# EasyEDA Pro project pdb.eprj, board can-bb5
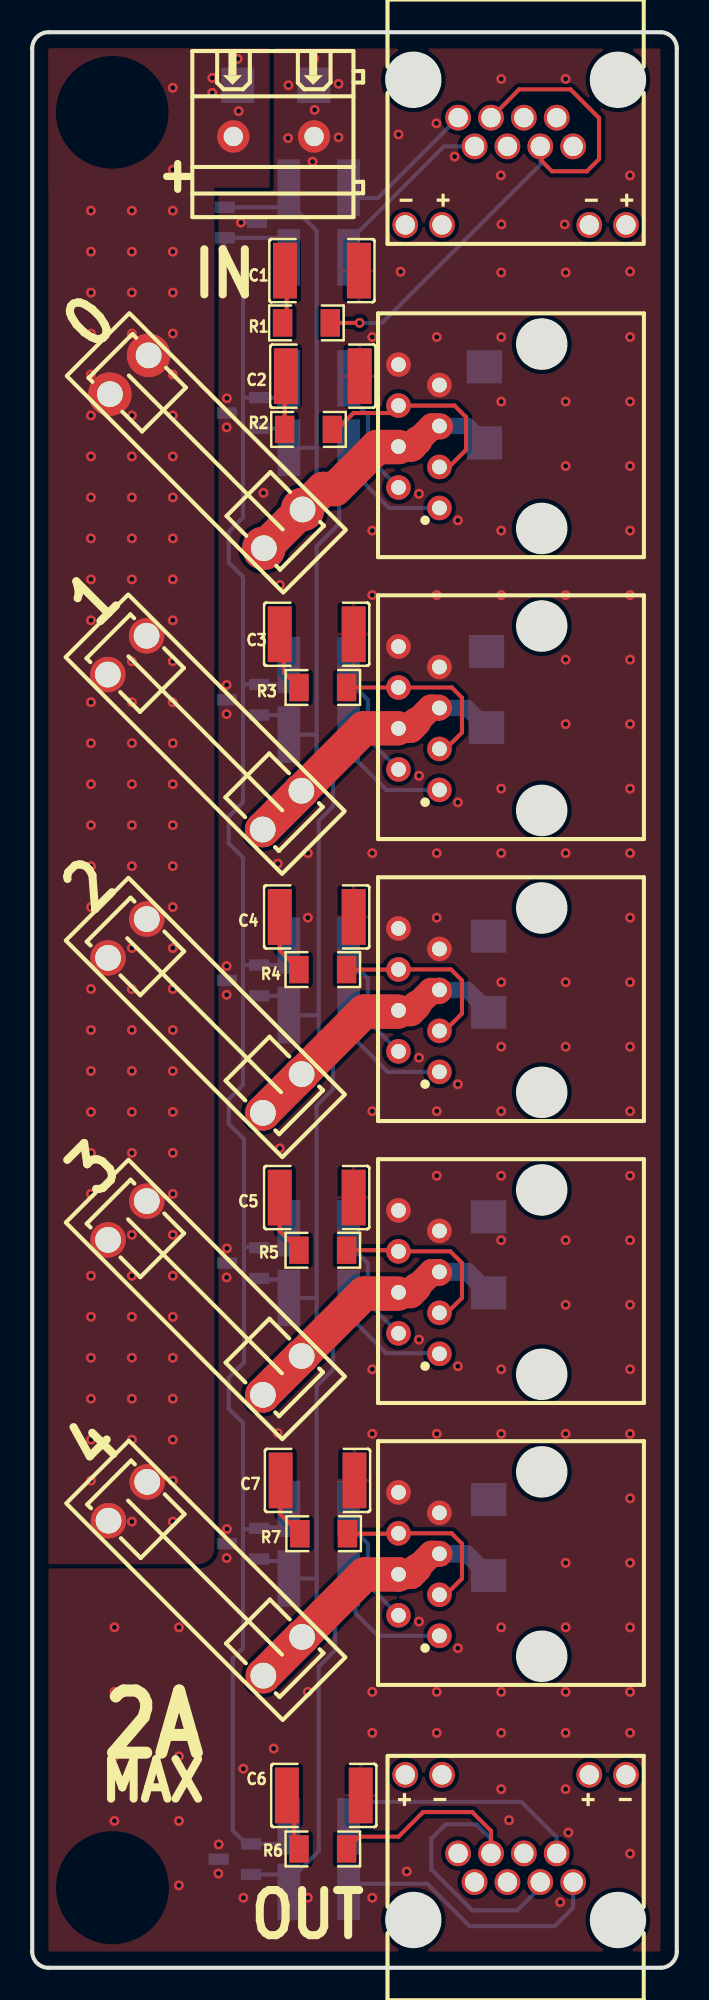
[diagram p7: board, top side]
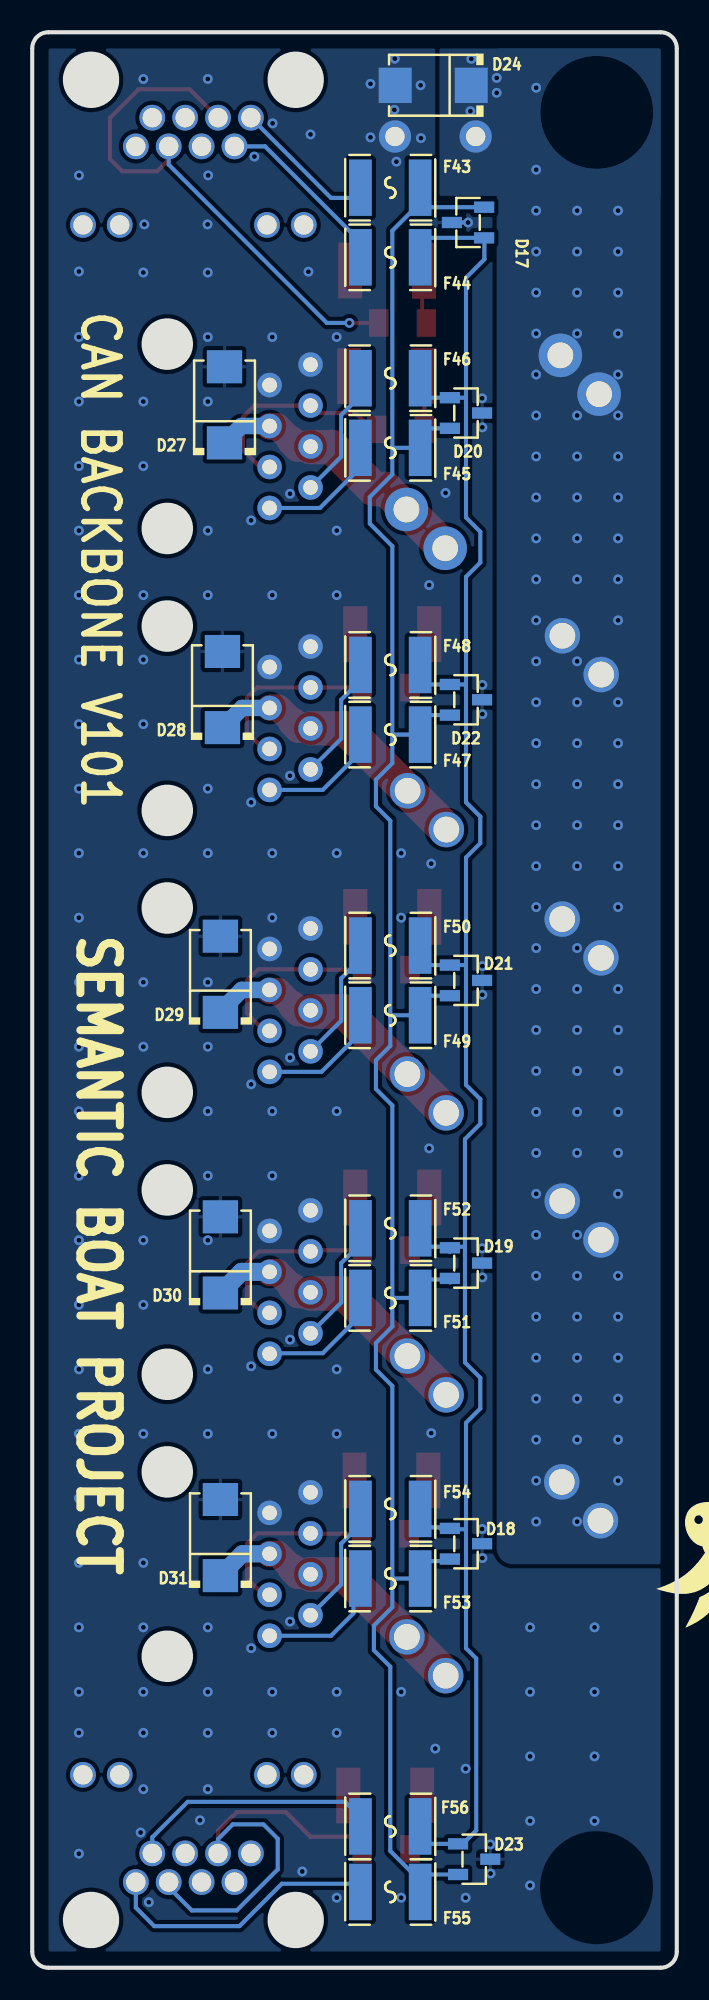
[diagram p8: board, bottom side, seen from below]

Outline 40 x 120 mm; copper layers: Top Layer, Bottom Layer. Coordinates in mm from the lower left corner of the outline.
Outline path: 0,119 0,1 arc(0.29,0.29) 1,0 39,0 arc(39.71,0.29) 40,1 40,119 arc(39.71,119.71) 39,120 1,120 arc(0.29,119.71) 0,119
Stack: Top Layer 0.035mm / Dielectric1 1.51mm FR4 er 4.5 / Bottom Layer 0.035mm

## Design rules (mm)
template: Custom Config
spacing copperThickness1oz (default): track to track 0.102, other pairs 0.152 to 0.3
spacing copperThickness2oz: track to track 0.203, other pairs 0.152 to 0.3
track width copperThickness1oz (default): min 0.127, default 0.254, max 10
track width copperThickness2oz: min 0.203, default 0.254, max 2.54
differential pair differentialPair (default): width min 0.127, default 0.254, max 2.54; gap min 0.152, default 0.152
via viaSize (default): diameter min 0.5, default 0.61, max 10; hole min 0.3, default 0.305, max 6.3

## Placement (name value [footprint] x y rotation side)
C1  100nF  [C1812]  17.98 105.22 180 top
C2  100nF  [C1812]  18.03 98.68 180 top
C3  100nF  [C1812]  17.65 82.68 180 top
C4  100nF  [C1812]  17.65 65.15 180 top
C5  100nF  [C1812]  17.65 47.75 180 top
C6  100nF  [C1812]  18.09 10.68 180 top
C7  100nF  [C1812]  17.71 30.21 180 top
D17  PESD2CAN  [SOT-23-3_L2.9-W1.3-P1.90-LS2.4-BR]  12.95 108.2 180 bottom
D18  PESD2CAN  [SOT-23-3_L2.9-W1.3-P1.90-LS2.4-BR]  13.08 26.29 0 bottom
D19  PESD2CAN  [SOT-23-3_L2.9-W1.3-P1.90-LS2.4-BR]  13.08 43.69 0 bottom
D20  PESD2CAN  [SOT-23-3_L2.9-W1.3-P1.90-LS2.4-BR]  13.08 96.39 0 bottom
D21  PESD2CAN  [SOT-23-3_L2.9-W1.3-P1.90-LS2.4-BR]  13.08 61.21 0 bottom
D22  PESD2CAN  [SOT-23-3_L2.9-W1.3-P1.90-LS2.4-BR]  13.08 78.61 0 bottom
D23  PESD2CAN  [SOT-23-3_L2.9-W1.3-P1.90-LS2.4-BR]  12.57 6.73 0 bottom
D24  SMBJ20A  [SMB_L4.6-W3.6-LS5.3-RD]  15.11 116.71 0 bottom
D27  SMBJ20A  [SMB_L4.6-W3.6-LS5.3-RD]  28.07 96.9 90 bottom
D28  SMBJ20A  [SMB_L4.6-W3.6-LS5.3-RD]  28.19 79.25 90 bottom
D29  SMBJ20A  [SMB_L4.6-W3.6-LS5.3-RD]  28.32 61.59 90 bottom
D30  SMBJ20A  [SMB_L4.6-W3.6-LS5.3-RD]  28.32 44.2 90 bottom
D31  SMBJ20A  [SMB_L4.6-W3.6-LS5.3-RD]  28.32 26.67 90 bottom
F01  T508  [CONN-TH_T508#2]  6.02 98.77 225 top
F02  T508  [CONN-TH_T508#2]  15.58 89.21 45 top
F11  T508  [CONN-TH_T508]  5.9 81.38 225 top
F12  T508  [CONN-TH_T508]  15.5 71.77 45 top
F21  T508  [CONN-TH_T508]  5.91 63.81 225 top
F22  T508  [CONN-TH_T508]  15.52 54.21 45 top
F31  T508  [CONN-TH_T508]  5.91 46.33 225 top
F32  T508  [CONN-TH_T508]  15.52 36.72 45 top
F41  T508  [CONN-TH_T508]  5.94 28.92 225 top
F42  T508  [CONN-TH_T508]  15.55 19.31 45 top
F43  MF-MSMF010-2  [F1812]  17.78 110.36 0 bottom
F44  MF-MSMF010-2  [F1812]  17.78 106.05 0 bottom
F45  MF-MSMF010-2  [F1812]  17.78 94.23 0 bottom
F46  MF-MSMF010-2  [F1812]  17.78 98.55 0 bottom
F47  MF-MSMF010-2  [F1812]  17.78 76.45 0 bottom
F48  MF-MSMF010-2  [F1812]  17.78 80.77 0 bottom
F49  MF-MSMF010-2  [F1812]  17.78 59.06 0 bottom
F50  MF-MSMF010-2  [F1812]  17.78 63.37 0 bottom
F51  MF-MSMF010-2  [F1812]  17.78 41.53 0 bottom
F52  MF-MSMF010-2  [F1812]  17.78 45.85 0 bottom
F53  MF-MSMF010-2  [F1812]  17.78 24.13 0 bottom
F54  MF-MSMF010-2  [F1812]  17.78 28.45 0 bottom
F55  MF-MSMF010-2  [F1812]  17.78 4.7 180 bottom
F56  MF-MSMF010-2  [F1812]  17.78 8.76 180 bottom
P1  WJ128V-5.0-02P-14-00A  [CONN-TH_2P-P5.00_WJ128V-5.0-2P]  14.99 113.54 180 top
R1  100Ω  [R1206]  17.02 101.98 0 top
R2  100Ω  [R1206]  17.15 95.38 0 top
R3  100Ω  [R1206]  18.03 79.38 0 top
R4  100Ω  [R1206]  18.03 61.89 0 top
R5  100Ω  [R1206]  18.03 44.49 0 top
R6  100Ω  [R1206]  18.03 7.37 0 top
R7  100Ω  [R1206]  18.09 26.91 0 top
RJ0  R-RJ45S08P-A004  [RJ45-TH_CKMTW_R-RJ45S08P-A004]  24 94.95 90 top
RJ1  R-RJ45S08P-A004  [RJ45-TH_CKMTW_R-RJ45S08P-A004]  24 77.47 90 top
RJ2  R-RJ45S08P-A004  [RJ45-TH_CKMTW_R-RJ45S08P-A004]  24 59.99 90 top
RJ3  R-RJ45S08P-A004  [RJ45-TH_CKMTW_R-RJ45S08P-A004]  24 42.51 90 top
RJ4  R-RJ45S08P-A004  [RJ45-TH_CKMTW_R-RJ45S08P-A004]  24 25.03 90 top
RJIN1  HC-RJ45-5JA-1-5  [RJ45-TH_HC-RJ45-5JA-1-5]  30 111.38 180 top
RJOUT1  HC-RJ45-5JA-1-5  [RJ45-TH_HC-RJ45-5JA-1-5]  30 8.64 0 top

## Footprints (pads in the part's own frame, mm; a bottom-side part is the same pattern mirrored in y, then rotated)
C1812
  rect 1.485x3.456 smd: 1(-2.292,0) 2(2.292,0)
CONN-TH_2P-P5.00_WJ128V-5.0-2P
  round 2 hole 1.2: 1(-2.505,0) 2(2.505,0)
CONN-TH_T508
  round 2.2 hole 1.6: 1(1.7,0) 2(-1.7,0)
CONN-TH_T508#2
  round 2.7 hole 1.6: 1(1.7,0) 2(-1.7,0)
F1812
  rect 1.407x3.499 smd: 1(-1.853,0) 2(1.853,0)
R1206
  rect 1.208x1.701 smd: 1(-1.479,0) 2(1.479,0)
RJ45-TH_CKMTW_R-RJ45S08P-A004
  round 1.524 hole 0.914: 1(-4.445,-1.27) 2(-3.175,1.27) 3(-1.905,-1.27) 4(-0.635,1.27) 5(0.635,-1.27) 6(1.905,1.27) 7(3.175,-1.27) 8(4.445,1.27)
RJ45-TH_HC-RJ45-5JA-1-5
  round 1.6 hole 1.2: 1(3.57,-3.325) 2(2.55,-1.545) 3(1.53,-3.325) 4(0.51,-1.545) 5(-0.51,-3.325) 6(-1.53,-1.545) 7(-2.55,-3.325) 8(-3.57,-1.545) 9(-6.85,3.325) 10(-4.57,3.325) 11(4.57,3.325) 12(6.85,3.325)
SMB_L4.6-W3.6-LS5.3-RD
  rect 2.047x2.192 smd: 1(-2.361,0) 2(2.361,0)
SOT-23-3_L2.9-W1.3-P1.90-LS2.4-BR
  rect 1.25x0.7 smd: 1(1,-0.95) 2(1,0.95) 3(-1,0)

## Nets
As in the schematic.

Pads without a net: RJIN1 4 5 7 8 9 10 11 12; RJOUT1 4 5 7 8 9 10 11 12

## Via types
v1: diameter 0.61, hole 0.305, Top Layer to Bottom Layer, 241 vias

## Routing (per net, layer and track width the routed paths; a pad name or vN(x,y) marks a point on that pad's centre or on a via; arc(x,y) is an arc through that point)
GND: length 1
  Bottom Layer w0.254: D17.3 v1(12.95,108.2)
  vias: v1(5.1,21.1) v1(5.1,17.1) v1(5.1,13.1) v1(5.1,9.1) v1(9.1,21.1) v1(9.1,17.1) v1(9.1,13.1) v1(9.1,9.1) v1(9.1,5.1) v1(11.57,7.65) v1(11.56,5.84) v1(12.08,97.31) v1(12.06,95.5) v1(12.06,79.54) v1(12.06,77.72) v1(12.06,62.1) v1(12.06,60.33) v1(12.08,44.6) v1(12.06,42.8) v1(12.08,27.2) v1(12.06,25.4) v1(13.1,12.34) v1(13.1,4.34) v1(14.35,91.44) v1(14.99,13.59) v1(15.24,68.45) v1(15.24,33.15) v1(15.37,85.72) v1(15.37,50.8) v1(15.9,116.71) v1(15.88,113.44) v1(17.1,69.1) v1(17.1,65.1) v1(17.1,17.1) v1(17.1,4.34) v1(17.4,111.98) v1(17.5,118.36) v1(17.53,115.19) v1(19.01,116.8) v1(19.01,113.48) v1(21.1,101.1) v1(21.1,89.1) v1(21.1,85.1) v1(21.1,69.1) v1(21.1,53.1) v1(21.1,37.1) v1(21.1,33.1) v1(21.1,17.1) v1(21.1,14.56) v1(21.1,4.34) v1(22.73,113.66) v1(22.86,105.16) v1(23.24,5.97) v1(24,91.39) v1(24,73.91) v1(24,56.42) v1(24,38.94) v1(24,21.46) v1(25.08,114.35) v1(25.1,101.1) v1(25.1,85.1) v1(25.1,69.1) v1(25.1,65.1) v1(25.1,53.1) v1(25.1,49.1) v1(25.1,33.1) v1(25.1,17.1) v1(25.1,14.56) v1(26.21,112.29) v1(26.42,89.73) v1(26.42,72.25) v1(26.42,54.77) v1(26.42,37.29) v1(26.42,19.81) v1(29.1,117.1) v1(29.08,111.12) v1(29.12,108.09) v1(29.1,105.1) v1(29.1,101.1) v1(29.1,97.1) v1(29.1,89.1) v1(29.1,85.1) v1(29.1,73.1) v1(29.1,69.1) v1(29.1,61.1) v1(29.1,57.1) v1(29.1,53.1) v1(29.1,49.1) v1(29.1,45.1) v1(29.1,37.1) v1(29.1,33.1) v1(29.1,21.1) v1(29.1,17.1) v1(29.1,14.56) v1(29.1,11.07) v1(29.59,9.14) v1(32.77,4.06) v1(33.04,108.09) v1(33.1,117.1) v1(33.1,105.1) v1(33.1,97.1) v1(33.1,93.1) v1(33.1,85.1) v1(33.1,81.1) v1(33.1,77.1) v1(33.1,69.1) v1(33.1,61.1) v1(33.1,57.1) v1(33.1,45.1) v1(33.1,41.1) v1(33.1,33.1) v1(33.1,25.1) v1(33.1,21.1) v1(33.1,17.1) v1(33.1,14.56) v1(33.1,11.07) v1(33.27,8.38) v1(37.1,111.12) v1(37.1,105.17) v1(37.1,101.1) v1(37.1,97.1) v1(37.1,93.1) v1(37.1,89.1) v1(37.1,85.1) v1(37.1,81.1) v1(37.1,77.1) v1(37.1,73.1) v1(37.1,69.1) v1(37.1,65.1) v1(37.1,61.1) v1(37.1,57.1) v1(37.1,53.1) v1(37.1,49.1) v1(37.1,45.1) v1(37.1,41.1) v1(37.1,37.1) v1(37.1,33.1) v1(37.1,29.1) v1(37.1,25.1) v1(37.1,21.1) v1(37.1,17.1) v1(37.1,14.56) v1(37.1,7.07)
VCC:
  vias: v1(3.64,108.94) v1(3.64,106.4) v1(3.64,103.86) v1(3.64,101.32) v1(3.64,98.78) v1(3.64,96.24) v1(3.64,93.7) v1(3.64,91.16) v1(3.64,88.62) v1(3.64,86.08) v1(3.64,83.54) v1(3.64,78.46) v1(3.64,75.92) v1(3.64,73.38) v1(3.64,70.84) v1(3.64,68.3) v1(3.64,65.76) v1(3.64,60.68) v1(3.64,58.14) v1(3.64,55.6) v1(3.64,53.06) v1(3.64,50.52) v1(3.64,47.98) v1(3.64,42.9) v1(3.64,40.36) v1(3.64,37.82) v1(3.64,35.28) v1(3.64,32.74) v1(3.64,30.2) v1(6.18,108.94) v1(6.18,106.4) v1(6.18,103.86) v1(6.18,101.32) v1(6.18,96.24) v1(6.18,93.7) v1(6.18,91.16) v1(6.18,88.62) v1(6.18,86.08) v1(6.18,81) v1(6.18,78.46) v1(6.18,75.92) v1(6.18,73.38) v1(6.18,70.84) v1(6.18,68.3) v1(6.18,63.22) v1(6.18,60.68) v1(6.18,58.14) v1(6.18,55.6) v1(6.18,53.06) v1(6.18,50.52) v1(6.18,45.44) v1(6.18,42.9) v1(6.18,40.36) v1(6.18,37.82) v1(6.18,35.28) v1(6.18,32.74) v1(6.18,27.66) v1(8.72,116.56) v1(8.72,111.48) v1(8.72,108.94) v1(8.72,106.4) v1(8.72,103.86) v1(8.72,101.32) v1(8.72,98.78) v1(8.72,96.24) v1(8.72,93.7) v1(8.72,91.16) v1(8.72,88.62) v1(8.72,86.08) v1(8.72,83.54) v1(8.72,81) v1(8.72,78.46) v1(8.72,75.92) v1(8.72,73.38) v1(8.72,70.84) v1(8.72,68.3) v1(8.72,65.76) v1(8.72,63.22) v1(8.72,60.68) v1(8.72,58.14) v1(8.72,55.6) v1(8.72,53.06) v1(8.72,50.52) v1(8.72,47.98) v1(8.72,45.44) v1(8.72,42.9) v1(8.72,40.36) v1(8.72,37.82) v1(8.72,35.28) v1(8.72,32.74) v1(8.72,30.2) v1(8.72,27.66) v1(11.18,117.17) v1(11.18,116.25) v1(12.75,118.35) v1(12.81,115.11)
$1N12647: length 17.3
  Top Layer w1.625: 25.3,95.56 24.81,95.56 23.91,94.66
  Top Layer w1.829: 23.91,94.66 23.54,94.29 22.76,94.29
  Top Layer w2.134: 22.75,94.28 21.4,94.28 18.8,91.68 18.05,91.68 F02.1
  Top Layer w2.184: F02.2 F02.1
  Bottom Layer w1.016: D27.1 27.02,95.59 RJ0.5
$1N13070: length 17.5
  Top Layer w1.625: 23.83,77.22 24.73,78.12 25.23,78.12
  Top Layer w1.829: 23.83,77.22 23.46,76.85 22.69,76.85
  Top Layer w2.134: 22.68,76.84 20.58,76.84 F12.1
  Top Layer w2.184: F12.2 F12.1
  Bottom Layer w1.016: D28.1 26.98,78.11 RJ1.5
$1N13136: length 17.5
  Top Layer w1.625: 23.85,59.66 24.75,60.56 25.24,60.56
  Top Layer w1.829: 23.85,59.66 23.48,59.29 22.7,59.29
  Top Layer w2.134: F22.1 20.59,59.28 22.69,59.28
  Top Layer w2.184: F22.2 F22.1
  Bottom Layer w1.016: 28.19,59.36 28.19,59.44 27,60.62 RJ2.5
$1N13202: length 17.5
  Top Layer w1.625: 23.85,42.18 24.8,43.13 25.19,43.13 25.24,43.07
  Top Layer w1.829: 22.7,41.8 23.48,41.8 23.85,42.18
  Top Layer w2.134: F32.1 20.59,41.79 22.69,41.79
  Top Layer w2.184: 14.31,35.52 F32.1
  Bottom Layer w1.117: RJ3.5 27.01,43.14 28.19,41.96
$1N14122: length 33.8
  Top Layer w0.254: RJIN1.3 30.22,116.46 33.4,116.46 35.18,114.68 35.18,112.14 34.42,111.38 32.26,111.38 31.62,112.01 31.62,112.83 RJIN1.6 ; 18.75,101.98 v1(20.32,101.98)
  Bottom Layer w0.254: RJIN1.6 31.53,111.79 21.72,101.98 v1(20.32,101.98)
$1N14137: length 13.2
  Top Layer w0.254: 18.62,95.63 19.18,95.63 19.94,96.39 22.27,96.39 RJ0.6 26.21,96.86 26.92,96.14 26.92,94.11 25.86,93.05 RJ0.3
$1N14157: length 11.4
  Top Layer w0.254: RJ1.6 26.03,79.38 26.67,78.74 26.67,76.58 25.66,75.57 RJ1.3 ; R3.2 22.73,79.38
$1N14180: length 11.3
  Top Layer w0.254: R4.2 22.72,61.89 RJ2.6 25.99,61.89 26.67,61.21 26.67,59.16 25.6,58.08 RJ2.3
$1N14200: length 11.4
  Top Layer w0.254: RJ3.3 25.75,40.6 26.67,41.53 26.67,43.69 25.94,44.41 RJ3.6 22.66,44.49 R5.2
$1N14223: length 27.8
  Top Layer w0.254: RJOUT1.6 28.47,8.49 27.31,9.65 24.26,9.65 22.73,8.13 20.28,8.13 R6.2
  Bottom Layer w0.254: RJOUT1.6 28.47,7.98 27.56,8.89 25.65,8.89 24.76,8 24.76,6.1 27.31,3.56 30.1,3.56 31.53,4.99 RJOUT1.3
$1N14688: length 3.6
  Top Layer w0.254: 15.8,10.68 16.26,10.23 16.26,7.66 16.56,7.37
$1N14698: length 3.8
  Top Layer w0.254: R5.1 15.36,45.68 C5.2
$1N14709: length 3.8
  Top Layer w0.254: C4.2 15.37,65.14 15.37,63.07 R4.1
$1N14720: length 3.8
  Top Layer w0.254: C3.2 15.62,82.42 15.62,80.31 16.56,79.38
$1N14731: length 3.3
  Top Layer w0.254: 15.67,95.63 15.67,98.86 15.74,98.93
$1N14742: length 3.3
  Top Layer w0.254: 15.68,105.47 15.79,105.37 15.79,102.23
$1N16789: length 17.5
  Top Layer w1.625: RJ4.5 24.77,25.66 23.88,24.76
  Top Layer w1.829: 23.88,24.76 23.5,24.39 RJ4.4
  Top Layer w2.134: RJ4.4 22.72,24.38 20.62,24.38 16.75,20.51
  Top Layer w2.184: F42.2 16.75,20.51
  Bottom Layer w1.067: RJ4.5 26.97,25.66 28.19,24.44
$1N16794: length 11.4
  Top Layer w0.254: 19.56,26.91 22.71,26.91 RJ4.6 26.03,26.93 26.67,26.29 26.67,24.13 25.66,23.12 RJ4.3
$1N16795: length 3.8
  Top Layer w0.254: C7.2 15.41,28.11 R7.1
$1N19163: length 7.9
  Bottom Layer w0.254: F45.2 19.63,93.02 22.14,90.51 RJ0.1
$1N19241: length 8.1
  Bottom Layer w0.254: F46.2 19.63,97.46 20.83,96.27 20.83,93.68 RJ0.2
$1N19280: length 9.1
  Bottom Layer w0.254: F43.2 20.27,109.73 21.45,109.73 RJIN1.1
$1N19317: length 11.2
  Bottom Layer w0.254: F44.2 19.63,107.01 25.55,112.92 RJIN1.2
$1N19397: length 7.7
  Bottom Layer w0.254: RJ1.1 21.97,73.03 20.07,74.93 20.07,76.02 F47.2
$1N19475: length 7.8
  Bottom Layer w0.254: F48.2 19.63,79.81 20.83,78.61 20.83,76.2 RJ1.2
$1N19555: length 7.7
  Bottom Layer w0.254: RJ2.1 22.05,55.55 20.07,57.53 20.07,58.62 F49.2
$1N19633: length 7.8
  Bottom Layer w0.254: RJ2.2 20.83,58.72 20.83,61.34 19.63,62.54 F50.2
$1N19713: length 7.5
  Bottom Layer w0.254: RJ3.1 25.23,38.1 21.97,38.1 20.07,40 20.07,40.84 19.63,41.28
$1N19791: length 7.5
  Bottom Layer w0.254: 19.63,45.59 19.63,44.88 20.83,43.69 20.83,41.24 RJ3.2
$1N19871: length 8.1
  Bottom Layer w0.254: F53.2 20.07,23.7 20.07,21.97 21.45,20.58 RJ4.1
$1N19949: length 7.6
  Bottom Layer w0.254: RJ4.2 20.83,23.76 20.83,26.29 19.63,27.48 19.63,28.19
$1N20029: length 17.3
  Bottom Layer w0.254: F55.1 20.14,5.21 24.51,5.21 27.14,2.58 32.43,2.58 33.57,3.72 RJOUT1.1
$1N20061: length 140.9
  Bottom Layer w0.254: 17.65,94.29 17.65,92.58 19.05,91.19 19.05,89.53 17.65,88.14 17.65,76.4 ; 17.65,94.29 17.65,107.7 15.93,109.42 ; 17.65,94.29 17.59,94.23 F45.1 15.93,94.94 15.43,95.44 D20.2 ; 17.65,41.59 17.65,53.47 18.67,54.48 18.67,56.26 17.78,57.15 17.78,58.98 ; 17.65,41.59 17.65,39.75 18.67,38.74 18.67,37.08 17.65,36.07 17.65,24.11 ; 17.65,41.59 17.59,41.53 F51.1 15.93,42.24 15.49,42.67 14.27,42.67 14.08,42.48 ; F43.1 15.93,109.65 15.43,109.15 D17.2 ; 15.93,5.39 F55.2 ; 15.93,5.39 17.78,7.24 17.78,18.67 18.8,19.69 18.8,21.21 17.65,22.35 17.65,24.11 ; 15.93,5.39 15.93,5.41 15.56,5.78 D23.2 ; 17.78,58.98 17.78,71.12 18.67,72.01 18.67,73.66 17.65,74.68 17.65,76.4 ; 17.78,58.98 17.71,59.06 F49.1 15.93,59.77 15.43,60.26 D21.2 ; 17.65,76.4 17.6,76.45 F47.1 15.93,77.29 15.56,77.66 D22.2 ; 17.65,24.11 17.63,24.13 F53.1 15.93,24.84 15.56,25.21 14.08,25.21
$1N20121: length 15.8
  Bottom Layer w0.254: F56.1 19.63,9.35 20.57,10.29 30.35,10.29 32.55,8.09 RJOUT1.2
$1N20153: length 130.9
  Bottom Layer w0.254: 13.08,97.34 D20.1 15.56,97.34 15.93,97.71 F46.1 ; 13.08,97.34 13.08,104.78 11.94,105.92 11.94,107.24 ; 13.08,97.34 13.08,89.92 12.19,89.03 12.19,87.12 13.08,86.23 13.08,79.53 ; 13.08,27.19 14.03,27.19 14.08,27.24 ; 13.08,27.19 13.08,19.81 12.45,19.18 12.45,8.51 13.27,7.68 D23.1 15.68,7.68 15.93,7.93 F56.2 ; 13.08,27.19 13.08,33.78 12.19,34.67 12.19,36.58 13.14,37.53 13.14,44.7 ; 15.93,106.76 15.43,107.25 D17.1 ; 13.08,62.15 13.09,62.16 D21.1 15.43,62.16 15.93,62.66 F50.1 ; 13.08,62.15 13.08,68.83 12.19,69.72 12.19,71.37 13.08,72.26 13.08,79.53 ; 13.08,62.15 13.08,54.74 12.19,53.85 12.19,52.32 13.14,51.37 13.14,44.7 ; 13.14,44.7 14.02,44.7 D19.1 ; F48.1 15.93,79.93 15.56,79.56 D22.1 13.12,79.56 13.08,79.53 ; 14.08,27.11 14.54,27.11 14.73,27.31 15.75,27.31 15.93,27.48 15.93,28.19 ; 15.93,107.52 15.93,106.81 ; 14.08,44.38 14.4,44.7 15.49,44.7 15.93,45.14 15.93,45.59

## Copper pours and planes (outline as drawn; the poured copper is in the pictures)
GND on Top Layer: -1.65,121.16 41.02,121.16 41.02,-1.52 -1.65,-1.52
GND on Bottom Layer: -1.27,121.28 41.66,121.28 41.66,-1.65 -1.27,-1.65
VCC on Top Layer: -1.27,119.9 -1.25,120.08 -1.2,120.27 -1.1,120.45 -0.98,120.61 -0.82,120.74 -0.64,120.83 -0.45,120.89 -0.27,120.9 10.3,120.9 10.48,120.89 10.67,120.83 10.85,120.74 11.01,120.61 11.14,120.45 11.23,120.27 11.29,120.08 11.3,119.9 11.3,26.02 11.29,25.84 11.23,25.65 11.14,25.47 11.01,25.31 10.85,25.18 10.67,25.09 10.48,25.03 10.3,25.02 -0.27,25.02 -0.45,25.03 -0.64,25.09 -0.82,25.18 -0.98,25.31 -1.1,25.47 -1.2,25.65 -1.25,25.84 -1.27,26.02
VCC on Top Layer: -1.27,120.9 14.73,120.9 14.73,110.36 -1.27,110.36
VCC on Bottom Layer: -1.27,119.9 -1.25,120.08 -1.2,120.27 -1.1,120.45 -0.98,120.61 -0.82,120.74 -0.64,120.83 -0.45,120.89 -0.27,120.9 10.18,120.9 10.35,120.89 10.55,120.83 10.73,120.74 10.88,120.61 11.01,120.45 11.1,120.27 11.16,120.08 11.18,119.9 11.18,26.02 11.16,25.84 11.1,25.65 11.01,25.47 10.88,25.31 10.73,25.18 10.55,25.09 10.35,25.03 10.18,25.02 -0.27,25.02 -0.45,25.03 -0.64,25.09 -0.82,25.18 -0.98,25.31 -1.1,25.47 -1.2,25.65 -1.25,25.84 -1.27,26.02
VCC on Bottom Layer: -1.27,120.9 14.73,120.9 14.73,109.85 -1.27,109.85

## Text on the board
Bottom Silkscreen Layer: CAN BACKBONE V101 | SEMANTIC BOAT PROJECT
Top Silkscreen Layer: + | MAX | IN | OUT | 0 | 2 | 1 | 3 | 4 | 2A
